# EAGLE design CufflessPTT- v3 (EAGLE 8.7.0)
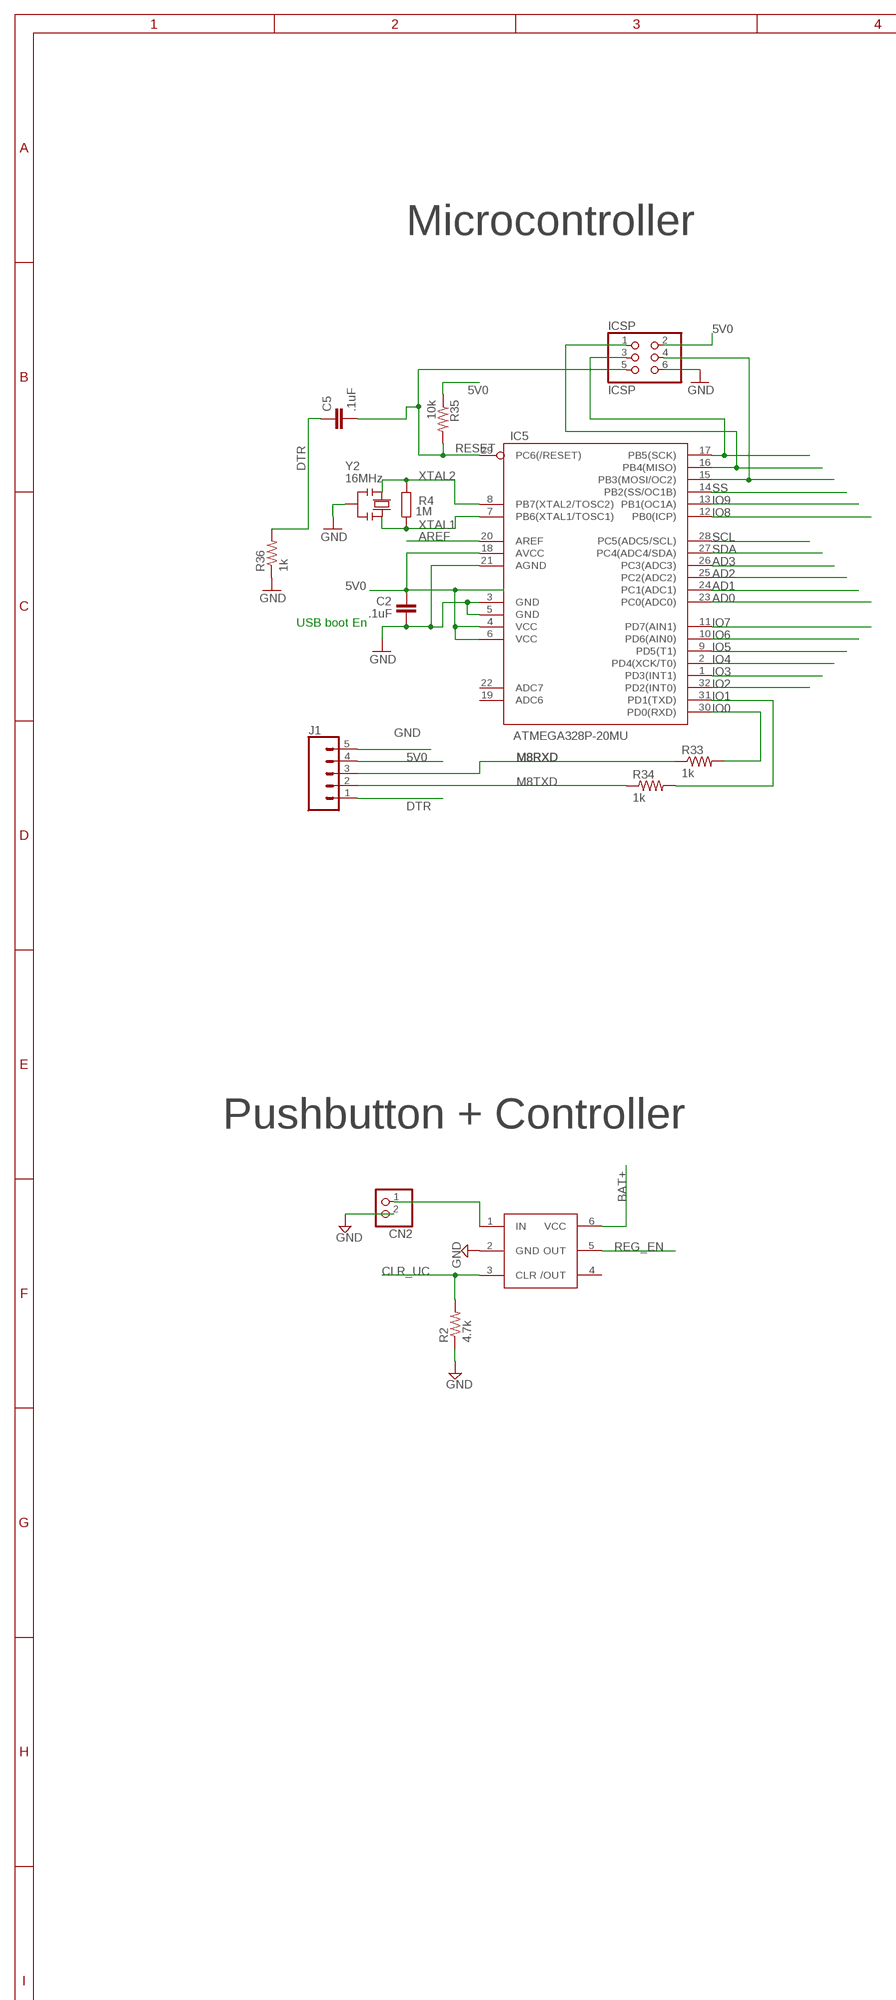
[diagram p0: schematic, sheet 1, part 1 of 2]
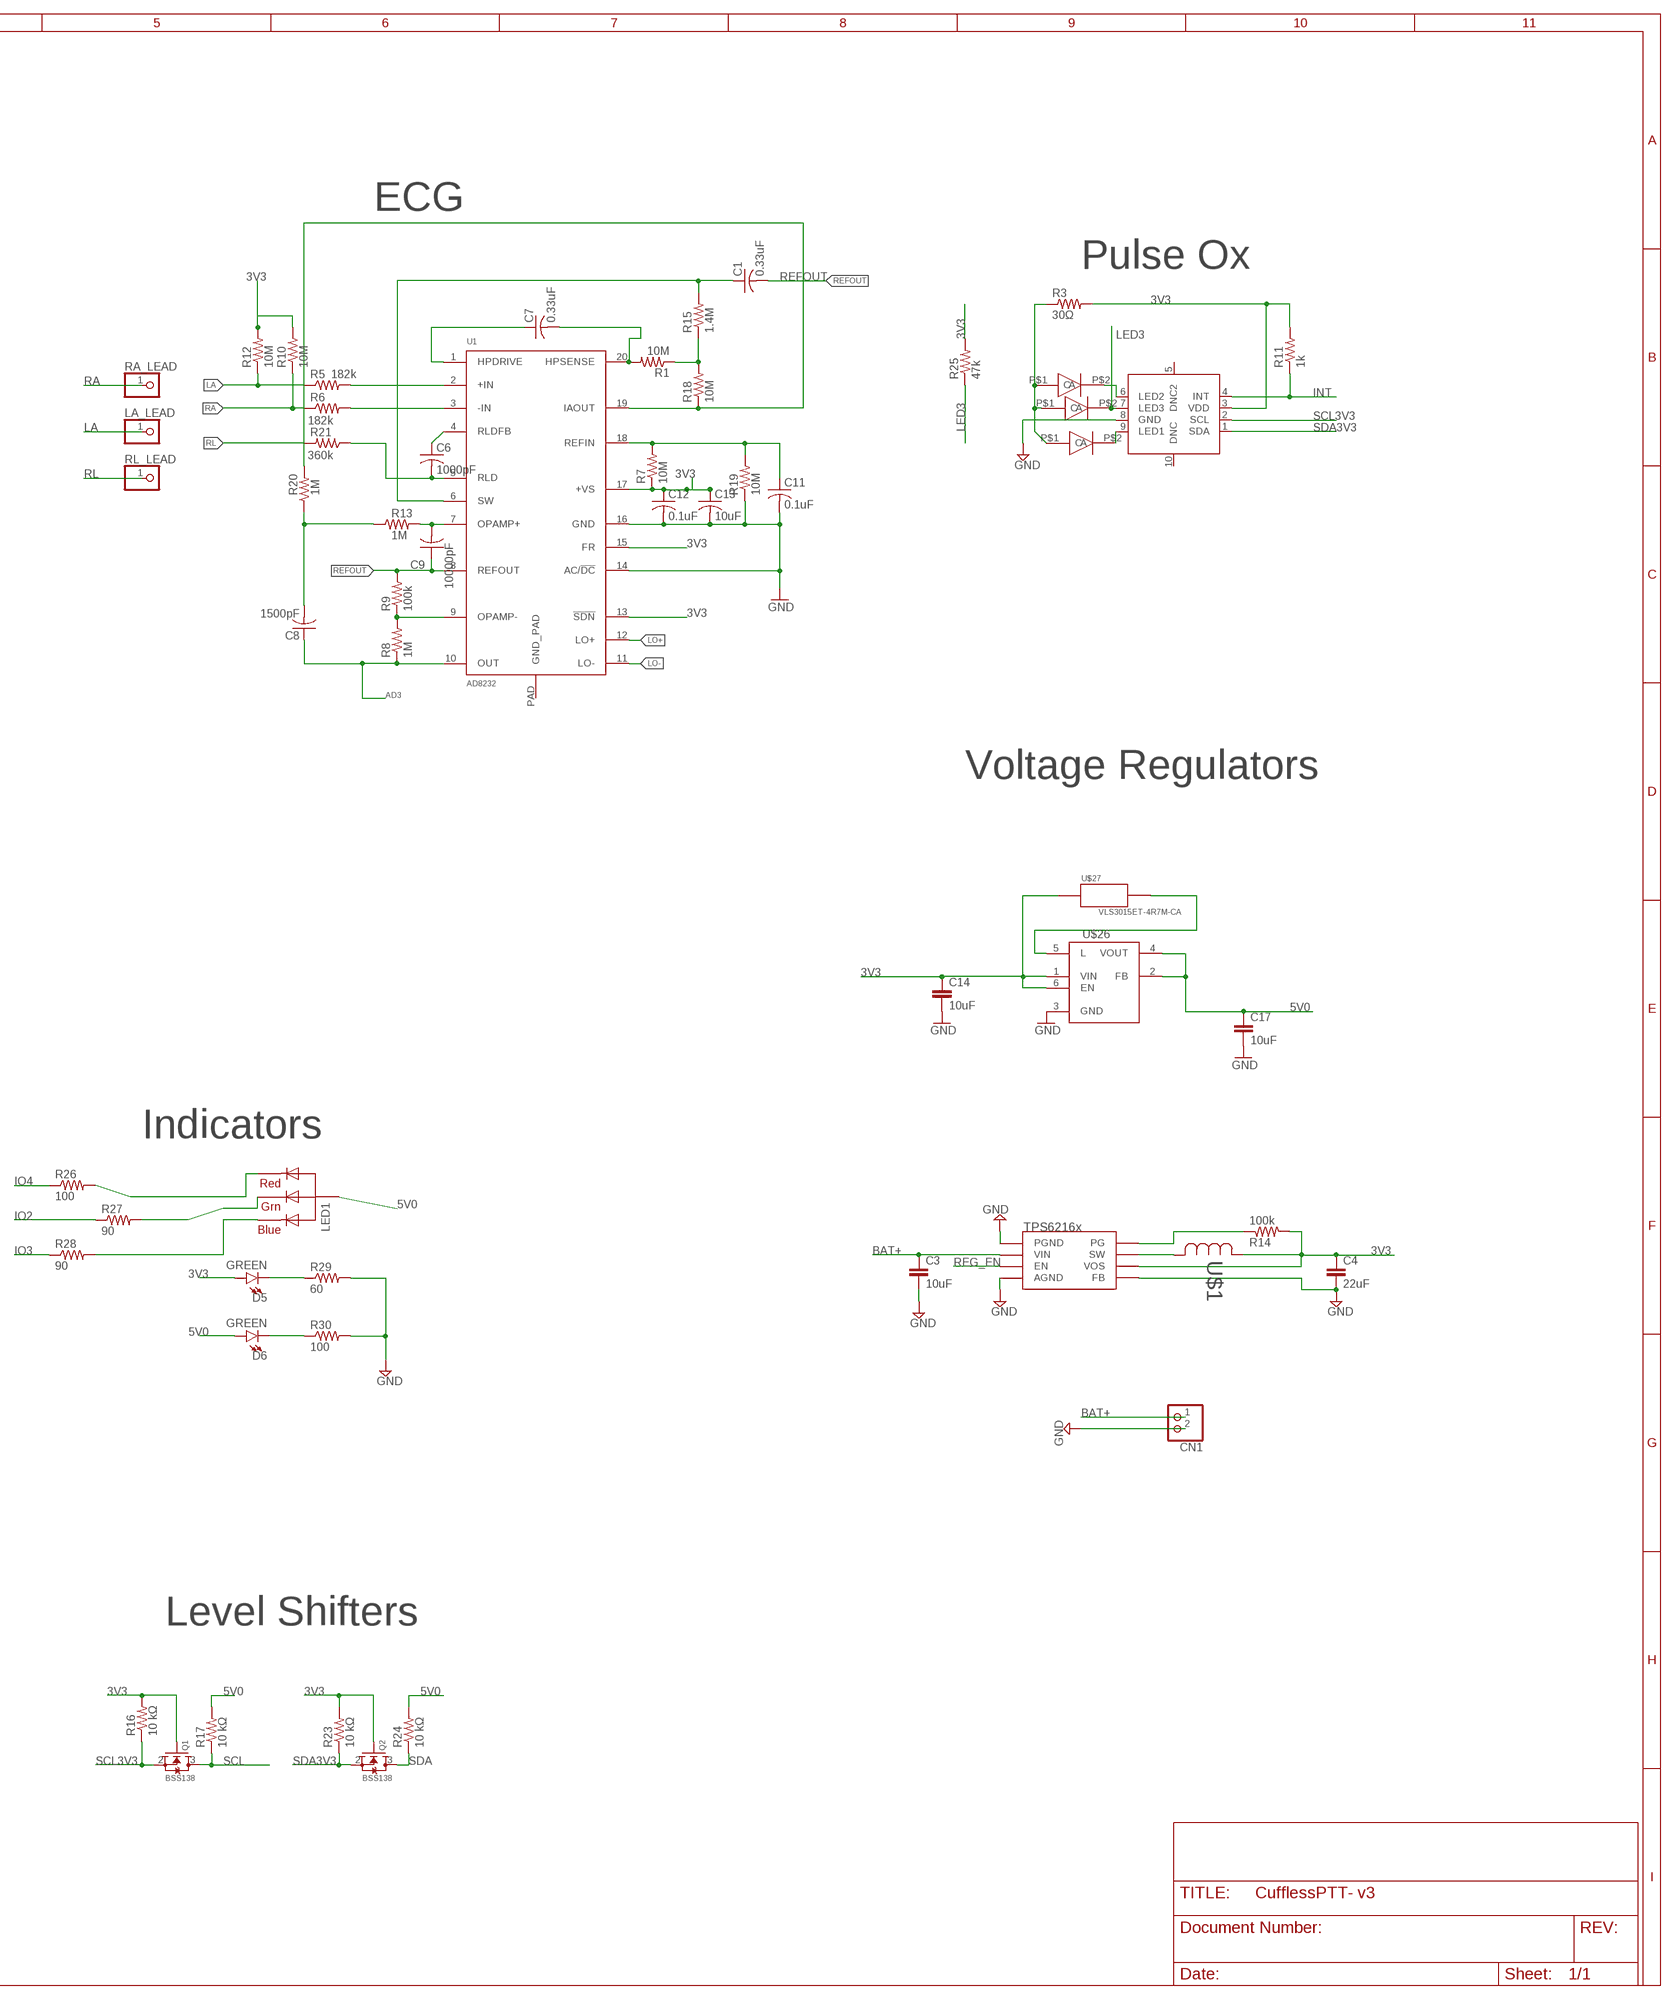
[diagram p1: schematic, sheet 1, part 2 of 2]

## Parts
C1  0.33uF  C-USC0603  [C0603]
C2  .1uF  C-EU0603-RND  [C0603-ROUND]
C3  10uF  C-EUC0603  [C0603]
C4  22uF  C-EUC0805  [C0805]
C5  .1uF  C-EU0603-RND  [C0603-ROUND]
C6  1000pF  C-USC0603  [C0603]
C7  0.33uF  C-USC0603  [C0603]
C8  1500pF  C-USC0603  [C0603]
C9  10000pF  C-USC0603  [C0603]
C11  0.1uF  C-USC0603  [C0603]
C12  0.1uF  C-USC0603  [C0603]
C13  10uF  C-USC0603  [C0603]
C14  10uF  C-EUC0603  [C0603]
C17  10uF  C-EUC0603  [C0603]
CN1  JST_2PIN-THM  [JST-PH-2-THM]
CN2  JST_2PIN-THM  [JST-PH-2-THM]
D5  GREEN  LED-GREEN0603  [LED-0603]
D6  GREEN  LED-GREEN0603  [LED-0603]
IC5  ATMEGA328P-20MU  MEGA8-MI  [MLF32]
ICSP  ICSP  PINHD-2X3  [2X03]
J1  CONN_05  [1X05]
LA_LEAD  PINHD-1X1  [1X01]
LED1  RGBLED_CA-5MM  [LED5MMRGB]
LED2  SMD_COMBO  [SMD_COMBO]
LED3  SMD_COMBO  [SMD_COMBO]
LED4  SMD_COMBO  [SMD_COMBO]
Q1  BSS138  [SOT23-3]
Q2  BSS138  [SOT23-3]
R1  10M  RESISTOR0603-RES  [0603-RES]
R2  4.7k  R-US_R0402  [R0402]
R3  30Ω  R-US_R0402  [R0402]
R4  1M  R-EU_R0603  [R0603-ROUND]
R5  182k  RESISTOR0603-RES  [0603-RES]
R6  182k  RESISTOR0603-RES  [0603-RES]
R7  10M  RESISTOR0603-RES  [0603-RES]
R8  1M  RESISTOR0603-RES  [0603-RES]
R9  100k  RESISTOR0603-RES  [0603-RES]
R10  10M  RESISTOR0603-RES  [0603-RES]
R11  1k  R-US_R0402  [R0402]
R12  10M  RESISTOR0603-RES  [0603-RES]
R13  1M  RESISTOR0603-RES  [0603-RES]
R14  100k  R-US_R0402  [R0402]
R15  1.4M  RESISTOR0603-RES  [0603-RES]
R16  10 kΩ  R-US_R0402  [R0402]
R17  10 kΩ  R-US_R0402  [R0402]
R18  10M  RESISTOR0603-RES  [0603-RES]
R19  10M  RESISTOR0603-RES  [0603-RES]
R20  1M  RESISTOR0603-RES  [0603-RES]
R21  360k  RESISTOR0603-RES  [0603-RES]
R23  10 kΩ  R-US_R0402  [R0402]
R24  10 kΩ  R-US_R0402  [R0402]
R25  47k  R-US_R0402  [R0402]
R26  100  R-US_R0402  [R0402]
R27  90  R-US_R0402  [R0402]
R28  90  R-US_R0402  [R0402]
R29  60  R-US_R0402  [R0402]
R30  100  R-US_R0402  [R0402]
R33  1k  R-US_R0402  [R0402]
R34  1k  R-US_R0402  [R0402]
R35  10k  R-US_R0402  [R0402]
R36  1k  R-US_R0402  [R0402]
RA_LEAD  PINHD-1X1  [1X01]
RL_LEAD  PINHD-1X1  [1X01]
U1  AD8232  [LFCSP_20]
U$1  VLF3012ST-2R2M1R4  [IND_3010]
U$4  SI1143  [QFN-10]
U$5  TPS6216X  [8WSON]
U$15  MAX16054  [TSOT23-6]
U$26  TPS61222  [SOT363_6SOIC]
U$27  VLS3015ET-4R7M-CA  [VLS3015ET-4R7M-CA]
Y2  16MHz  RESONATORMU  [RESONATOR]

## Nets
3V3: C4.1 C12.1 C13.1 C14.1 D5.A Q1.1(G) Q2.1(G) R3.2 R7.1 R10.2 R11.2 R12.2 R14.2 R16.2 R23.2 R25.2 U1.13(!SDN) U1.15(FR) U1.17(+VS) U$1.1 U$4.3(VDD) U$5.P$6(VOS) U$26.1(VIN) U$26.6(EN) U$27.1
5V0: C2.2 C17.1 D6.A IC5.4(VCC) IC5.6(VCC) IC5.18(AVCC) ICSP.2 J1.4 LED1.2(VCC) R17.2 R24.2 R35.1 U$26.2(FB) U$26.4(VOUT)
AD0: IC5.23(PC0(ADC0))
AD1: IC5.24(PC1(ADC1))
AD2: IC5.25(PC2(ADC2))
AD3: C8.1 IC5.26(PC3(ADC3)) R8.1 U1.10(OUT)
AREF [aref]: IC5.20(AREF)
BAT+: C3.1 CN1.1 U$5.P$2(VIN) U$15.6(VCC)
CLR_UC: R2.2 U$15.3(CLR)
DTR: C5.1 J1.1 R36.2
GND [gnd]: C2.1 C3.2 C4.2 C11.2 C12.2 C13.2 C14.2 C17.2 CN1.2 CN2.2 IC5.3(GND) IC5.5(GND) IC5.21(AGND) ICSP.6 J1.5 R2.1 R19.1 R29.2 R30.2 R36.1 U1.14(AC/!DC) U1.16(GND) U$4.8(GND) U$5.P$1(PGND) U$5.P$4(AGND) U$5.P$5(FB) U$5.P$9(AGND) U$15.2(GND) U$26.3(GND) Y2.2
INT: R11.1 U$4.4(INT)
IO0: IC5.30(PD0(RXD)) R33.2
IO1: IC5.31(PD1(TXD)) R34.2
IO2: IC5.32(PD2(INT0)) R27.1
IO3: IC5.1(PD3(INT1)) R28.1
IO4: IC5.2(PD4(XCK/T0)) R26.1
IO5: IC5.9(PD5(T1))
IO6: IC5.10(PD6(AIN0))
IO7: IC5.11(PD7(AIN1))
IO8: IC5.12(PB0(ICP))
IO9: IC5.13(PB1(OC1A))
LA: LA_LEAD.1 R5.1 R12.1
LED3: LED2.P$2(C) R25.1 U$4.7(LED3)
LO+: U1.12(LO+)
LO-: U1.11(LO-)
M8RXD: J1.3 R33.1
M8TXD: J1.2 R34.1
MISO: IC5.16(PB4(MISO)) ICSP.1
MOSI: IC5.15(PB3(MOSI/OC2)) ICSP.4
N$1: R5.2 U1.2(+IN)
N$2: CN2.1 U$15.1(IN)
N$3: C1.1 R15.2 U1.6(SW)
N$4: R1.1 R15.1 R18.2
N$5: C8.2 R13.1 R20.1
N$6: R14.1 U$5.P$8(PG)
N$7: R6.2 U1.3(-IN)
N$8: C9.2 R13.2 U1.7(OPAMP+)
N$10: D5.C R29.1
N$11: C7.2 R1.2 U1.20(HPSENSE)
N$12: C11.1 R7.2 R19.2 U1.18(REFIN)
N$13: U$1.2 U$5.P$7(SW)
N$14: R8.2 R9.1 U1.9(OPAMP-)
N$15: C7.1 U1.1(HPDRIVE)
N$17: C6.1 U1.4(RLDFB)
N$20: D6.C R30.1
N$21: R18.1 R20.2 U1.19(IAOUT)
N$23: C6.2 R21.1 U1.5(RLD)
N$24: LED2.P$1(A) LED3.P$1(A) LED4.P$1(A) R3.1
N$26: U$26.5(L) U$27.2
N$27: LED3.P$2(C) U$4.6(LED2)
N$29: LED1.4(BLUE) R28.2
N$30: LED1.3(GREEN) R27.2
N$31: LED1.1(RED) R26.2
N$32: LED4.P$2(C) U$4.9(LED1)
RA: R6.1 R10.1 RA_LEAD.1
REFOUT: C1.2 C9.1 R9.2 U1.8(REFOUT)
REG_EN: U$5.P$3(EN) U$15.5(OUT)
RESET: C5.2 IC5.29(PC6(/RESET)) ICSP.5 R35.2
RL: R21.2 RL_LEAD.1
SCK: IC5.17(PB5(SCK)) ICSP.3
SCL: IC5.28(PC5(ADC5/SCL)) Q1.3(D) R17.1
SCL3V3: Q1.2(S) R16.1 U$4.2(SCL)
SDA: IC5.27(PC4(ADC4/SDA)) Q2.3(D) R24.1
SDA3V3: Q2.2(S) R23.1 U$4.1(SDA)
SS: IC5.14(PB2(SS/OC1B))
XTAL1: IC5.7(PB6(XTAL1/TOSC1)) R4.1 Y2.3
XTAL2: IC5.8(PB7(XTAL2/TOSC2)) R4.2 Y2.1
Unconnected: IC5.19(ADC6) IC5.22(ADC7) U1.PAD(GND_PAD) U$4.5(DNC2) U$4.10(DNC) U$15.4(/OUT)

## Notes on the sheet
- Microcontroller | ECG
- Pulse Ox
- USB boot En
- Voltage Regulators
- Pushbutton + Controller
- Indicators
- Level Shifters

## Library data of the parts
C1 C6-C9 C11-C13 = rcl:C-US: CAPACITOR, American symbol
C2 C5 = SmartPrj:C-EU: CAPACITOR, European symbol
C3 C14 C17 = rcl:C-EU: CAPACITOR, European symbol; MPN: MCNP16V105M5X11; OC_NEWARK: 13M5148
C4 = rcl:C-EU: CAPACITOR, European symbol; OC_NEWARK: unknown
CN1 CN2 = adafruit:JST_2PIN: JST 2-Pin Connectors of various flavors SMT-RA (S2B-PH-SM4) 4UConnector #17311 SMT (B2B-PH-SM4) THM-RA (S2B-PH) THM (B2B-PH)
D5 D6 = SparkFun-LED:LED-GREEN: Green SMD LED Used in manufacturing of various products at SparkFun Packages: 0603 - SMD 0603 package [Product Link] <http://www.futureelectronics.com/en/technologies/semiconductors/optoelectronics/leds/Pages/9894312-LTST-C190GKT.aspx?CrossPart=HSMG-C190&IM=0> LilyPad 1206 - SMD1206 LilyPad package [Product Link] <http://www.futureelectronics.com/en/Technologies/Product.aspx?ProductID=IN150NGHARVATEKCORPORATION2049943&IM=0> 1206 - SMD1206 package [Product Link] <http://www.futureelectronics.com/en/technologies/semiconductors/optoelectronics/leds/Pages/8315665-LTST-C150KGKT.aspx?IM=0> 1206 Bottom Mount -SMD 1206 Bottom Mount [Product Link] <http://www.digikey.com/product-detail/en/lite-on-inc/LTST-C230KGKT/160-1456-1-ND/386854> SparkFun Products: Pro Mini 328 -5V <https://www.sparkfun.com/products/821> RedBoard <https://www.sparkfun.com/products/12757> MP3 Trigger <https://www.sparkfun.com/products/13720> Makey Makey <https://www.sparkfun.com/products/11076>; PROD_ID: DIO-00821
IC5 = idii:MEGA8: MICROCONTROLLER 8 Kbytes FLASH 1 kbytes SRAM 512 bytes EEPROM USART 6-channel 10 bit ADC 2-channel 8 bit ADC Source: avr.lbr
ICSP = pinhead:PINHD-2X3: PIN HEADER
J1 = SparkFun-Connectors:CONN_05: Multi connection point. Often used as Generic Header-pin footprint for 0.1 inch spaced/style header connections On any of the 0.1 inch spaced packages, you can populate with these: Break Away Headers - Straight <https://www.sparkfun.com/products/116> (PRT-00116) Break Away Male Headers - Right Angle <https://www.sparkfun.com/products/553> (PRT-00553) Female Headers <https://www.sparkfun.com/products/115> (PRT-00115) Break Away Headers - Machine Pin <https://www.sparkfun.com/products/117> (PRT-00117) Break Away Female Headers - Swiss Machine Pin <https://www.sparkfun.com/products/743> (PRT-00743) For SCREWTERMINALS and SPRING TERMINALS visit here: Screw Terimnals on SparkFun.com <https://www.sparkfun.com/search/results?term=Screw+Terminals> (5mm/3.5mm/2.54mm spacing) This device is also useful as a general connection point to wire up your design to another part of your project. Our various solder wires solder well into these plated through hole pads. Hook-Up Wire - Assortment (Stranded, 22 AWG) <https://www.sparkfun.com/products/11375> (PRT-11375) Hook-Up Wire - Assortment (Solid Core, 22 AWG) <https://www.sparkfun.com/products/11367> (PRT-11367) View the entire wire category on our website here <https://www.sparkfun.com/categories/141> Special notes: Molex polarized connector foot print use with SKU : PRT-08231 with associated crimp pins and housings. 1MM SMD Version SKU: PRT-10208
LA_LEAD RA_LEAD RL_LEAD = pinhead:PINHD-1X1: PIN HEADER
LED1 = adafruit:RGBLED_CA: RGB LED, common-anode 5MM Staggered pins 5mm Piranha package http://www.ladyada.net/library/pcb/eaglelibrary.html
LED2-LED4 = Allie_custom:SMD_COMBO
Q1 Q2 = Charles:BSS138: MOSFET N-CH 50V 220MA
R1 R5-R10 R12 R13 R15 R18-R21 = SparkFun-Passives:RESISTOR: Resistor Basic schematic elements and footprints for 0603, 1206, and PTH resistors.
R2 R3 R11 R25 = rcl:R-US_: RESISTOR, American symbol
R4 = SmartPrj:R-EU_: RESISTOR, European symbol
R14 = rcl:R-US_: RESISTOR, American symbol; OC_NEWARK: unknown; SPICEPREFIX: R
R16 R17 R23 R24 R33-R36 = rcl:R-US_: RESISTOR, American symbol; SPICEPREFIX: R
R26-R30 = resistor:R-US_: RESISTOR, American symbol
U1 = AD8232:AD8232
U$1 = Charles:VLF3012ST-2R2M1R4: 2.2µH Shielded Wirewound Inductor 1.4A 72 mOhm Max Nonstandard; OC_NEWARK: unknown
U$4 = Allie_custom:SI1143
U$5 = Charles:TPS6216X: 3-V to 17-V, 1-A Step-Down Converters with DCS-Control; OC_NEWARK: unknown
U$15 = James_custom:MAX16054
U$26 = James_Updated:TPS61222: Boost Switching Regulator IC Positive Fixed 5V/Adj Output 200mA (Switch); OC_NEWARK: unknown
U$27 = James_Updated:VLS3015ET-4R7M-CA: 4.7uH Shielded Wirewound Inductor 1.35A 136mOhm Max Nonstandard Packaging; OC_NEWARK: unknown
Y2 = SmartPrj:RESONATOR

## Net classes
1 power: width 0.406 mm, drill 0.61 mm, clearance 0.152 mm
2 gnd: width 0.203 mm, drill 0.559 mm, clearance 0.152 mm
3 usbvcc: width 0.203 mm, drill 0.61 mm, clearance 0.152 mm
4 aref: width 0.203 mm, drill 0.61 mm, clearance 0.152 mm

## Board
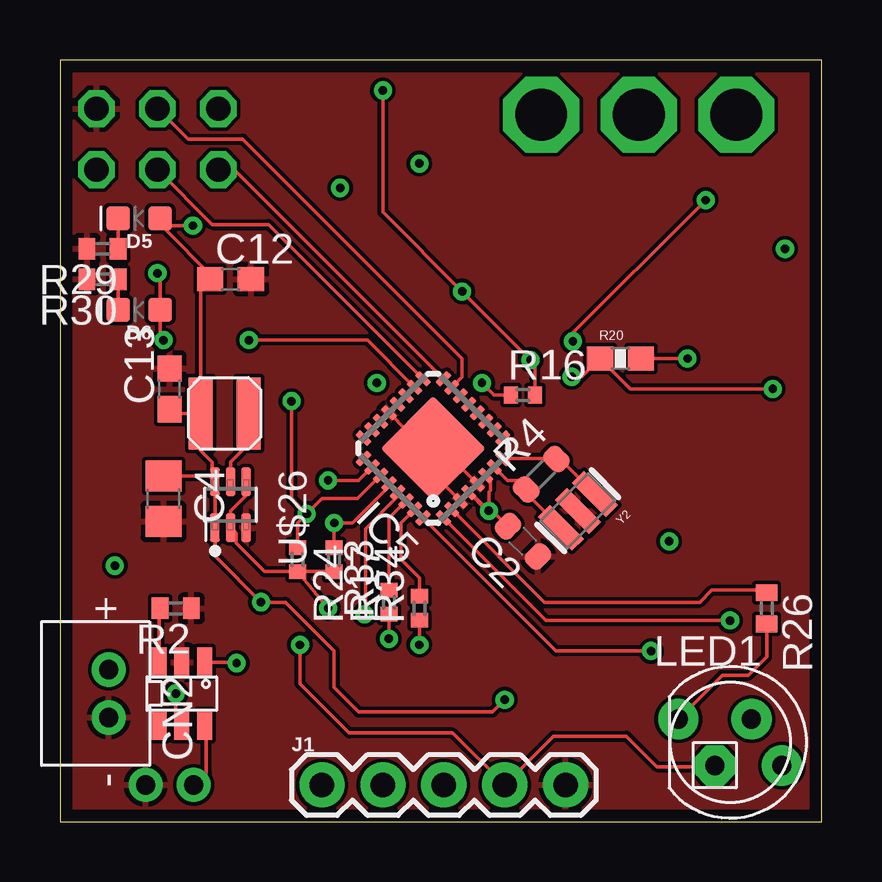
[diagram p2: board, top side]
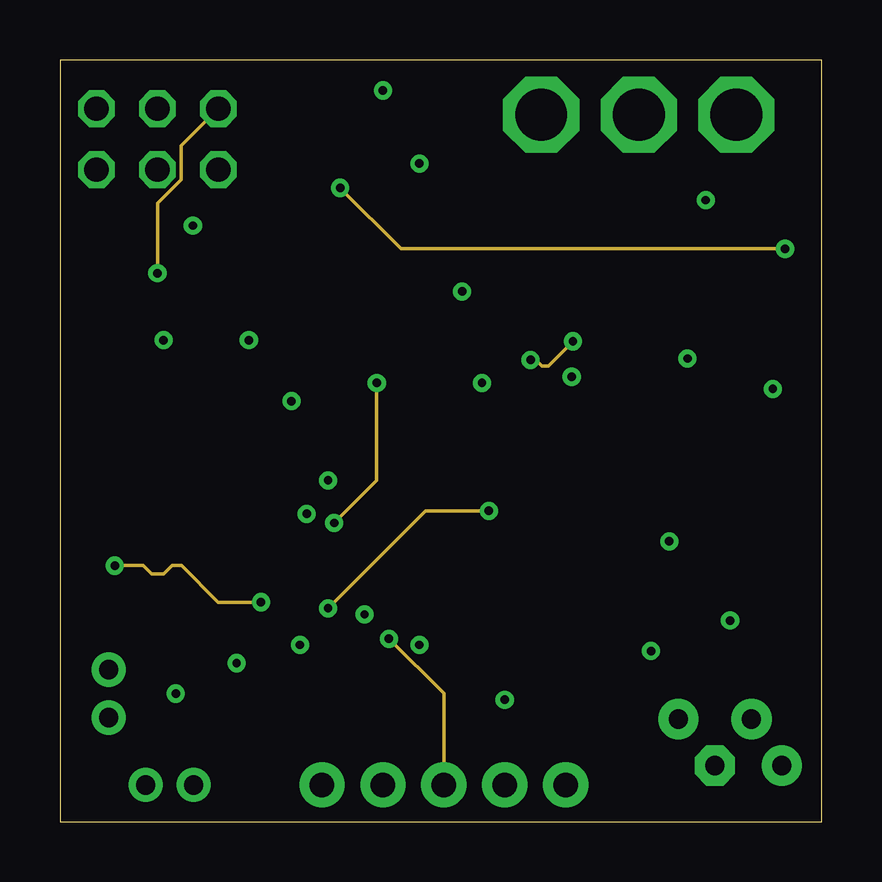
[diagram p3: board, inner layer Route2]
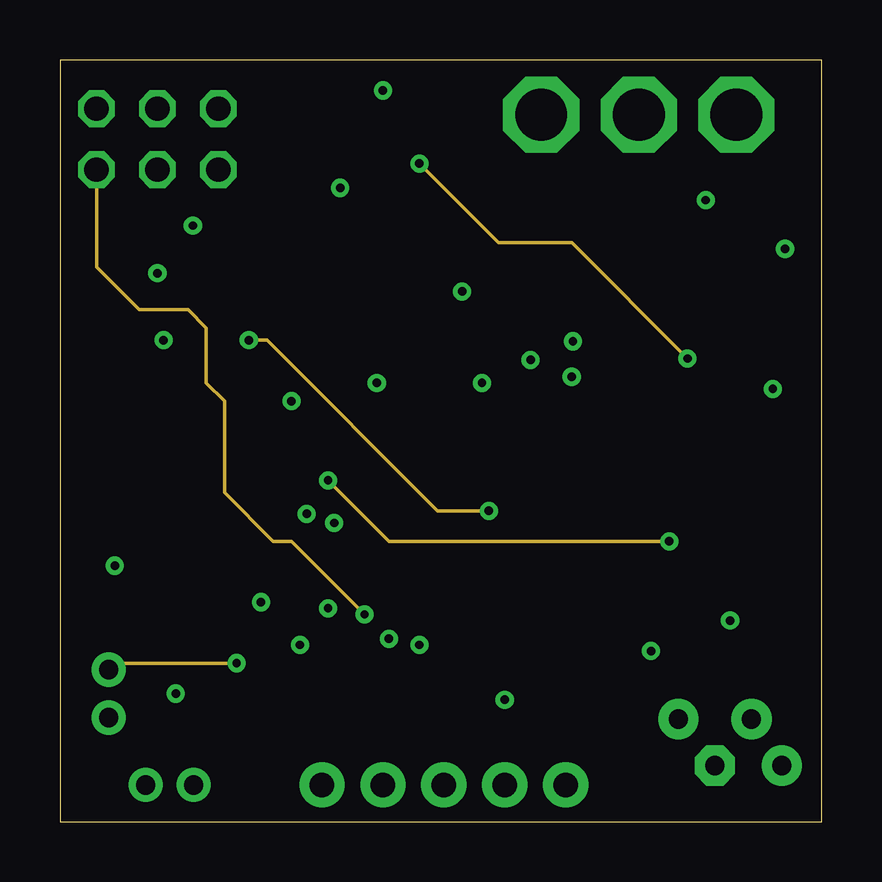
[diagram p4: board, inner layer Route15]
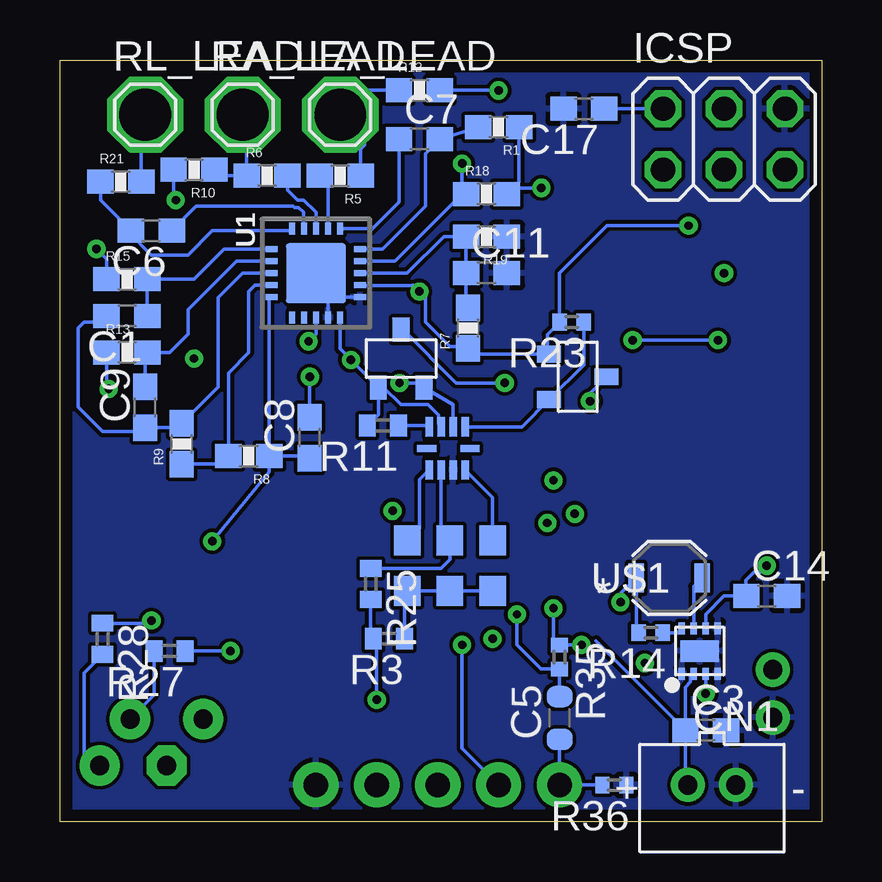
[diagram p5: board, bottom side, seen from below]

Size 31.75 x 31.75 mm. Coordinates in mm from the lower left corner, seen from the top.
Outline: 0,0 31.75,0 31.75,31.75 0,31.75 0,0
Copper layers (1*2+15*16): Top 0.035mm / dielectric 0.49mm / Route2 0.035mm / dielectric 0.49mm / Route15 0.035mm / dielectric 0.49mm / Bottom 0.035mm
Design rules "default *": minimum track width 1mil, minimum drill 8mil, track to track 6mil, track to pad 6mil, pad to pad 6mil, via to via 6mil, smd to smd 6mil, copper to edge 20mil, drill to drill 8mil, minimum pad ring 10mil, minimum via ring 8mil, stop-mask expansion 4mil, vias tented up to drill 0mil, thermal gap 8mil

### Footprints (pad centres in the part's own frame; a part is rotated, then mirrored left to right if it is on the bottom)
C0603 = smd 1.1 x 1: 1 -0.85,0; 2 0.85,0
C0603-ROUND = smd 0.898 x 1.1: 1 -0.889,0; 2 0.889,0
C0805 = smd 1.3 x 1.5: 1 -0.95,0; 2 0.95,0
JST-PH-2-THM = drill 0.8 pad 1.422: 1 1,0; 2 -1,0
LED-0603 = smd 1 x 1: A -0.877,0; C 0.877,0
MLF32 = smd 0.7 x 0.3: 1 -2.35,1.75; 2 -2.35,1.25; 3 -2.35,0.75; 4 -2.35,0.25; 5 -2.35,-0.25; 6 -2.35,-0.75; 7 -2.35,-1.25; 8 -2.35,-1.75; 17 2.35,-1.75; 18 2.35,-1.25; 19 2.35,-0.75; 20 2.35,-0.25; 21 2.35,0.25; 22 2.35,0.75; 23 2.35,1.25; 24 2.35,1.75 | smd 0.3 x 0.7: 9 -1.75,-2.35; 10 -1.25,-2.35; 11 -0.75,-2.35; 12 -0.25,-2.35; 13 0.25,-2.35; 14 0.75,-2.35; 15 1.25,-2.35; 16 1.75,-2.35; 25 1.75,2.35; 26 1.25,2.35; 27 0.75,2.35; 28 0.25,2.35; 29 -0.25,2.35; 30 -0.75,2.35; 31 -1.25,2.35; 32 -1.75,2.35 | smd 3.1 x 3.1: PAD 0,0
2X03 = drill 1.016 octagon: 1 -2.54,-1.27; 2 -2.54,1.27; 3 0,-1.27; 4 0,1.27; 5 2.54,-1.27; 6 2.54,1.27
1X05 = drill 1.016 pad 1.88: 1 0,0; 2 2.54,0; 3 5.08,0; 4 7.62,0; 5 10.16,0
1X01 = drill 2.159 octagon: 1 0,0
LED5MMRGB = drill 0.8 pad 1.676: 1 -2.159,0.968; 3 0.889,0.968; 4 2.159,-0.968 | drill 0.8 pad 1.676 octagon: 2 -0.635,-0.968
SMD_COMBO = smd 1.25 x 1.1: P$1 -1.05,0; P$2 1.05,0
SOT23-3 = smd 0.7 x 1: 1 -0.95,-1.2; 2 0.95,-1.2; 3 0,1.2
0603-RES = smd 1.1 x 1: 1 -0.85,0; 2 0.85,0
R0402 = smd 0.7 x 0.9: 1 -0.65,0; 2 0.65,0
R0603-ROUND = smd 0.898 x 1.1: 1 -0.889,0; 2 0.889,0
R0402' = smd 0.6 x 0.7: 1 -0.5,0; 2 0.5,0
LFCSP_20 = smd 0.5 x 0.25: 1 -1.85,1; 2 -1.85,0.5; 3 -1.85,0; 4 -1.85,-0.5; 5 -1.85,-1; 11 1.85,-1; 12 1.85,-0.5; 13 1.85,0; 14 1.85,0.5; 15 1.85,1 | smd 0.25 x 0.5: 6 -1,-1.85; 7 -0.5,-1.85; 8 0,-1.85; 9 0.5,-1.85; 10 1,-1.85; 16 1,1.85; 17 0.5,1.85; 18 0,1.85; 19 -0.5,1.85; 20 -1,1.85 | smd 2.5 x 2.5: PAD 0,0
IND_3010 = smd 0.65 x 1.2: 1 -1.375,0; 2 1.375,0
QFN-10 = smd 0.8 x 0.3: 1 -0.9,0.7; 2 -0.9,0.2; 3 -0.9,-0.3; 4 -0.9,-0.8; 6 0.9,-0.8; 7 0.9,-0.3; 8 0.9,0.2; 9 0.9,0.7 | smd 0.3 x 0.8: 5 0,-0.9; 10 0,0.9
8WSON = smd 0.5 x 0.28: P$1 -0.95,0.75; P$2 -0.95,0.25; P$3 -0.95,-0.25; P$4 -0.95,-0.75; P$5 0.95,-0.75; P$6 0.95,-0.25; P$7 0.95,0.25; P$8 0.95,0.75 | smd 0.9 x 1.6: P$9 0,0
TSOT23-6 = smd 0.62 x 1.22: 1 0.95,1.31; 2 0,1.31; 3 -0.95,1.31; 4 -0.95,-1.31; 5 0,-1.31; 6 0.95,-1.31
SOT363_6SOIC = smd 1.19 x 0.4: 1 -0.96,0.65; 2 -0.96,0; 3 -0.96,-0.65; 4 0.96,-0.65; 5 0.96,0; 6 0.96,0.65
VLS3015ET-4R7M-CA = smd 1 x 3: 1 -1,0; 2 1,0
RESONATOR = smd 0.7 x 2: 1 -1,0; 2 0,0; 3 1,0

### Placement (x,y rotation side)
C1  28.96,21.08 180 bottom
C2  19.3,11.68 135 top
C3  4.83,3.81 0 bottom
C4  4.32,13.46 270 top
C5  10.92,4.32 90 bottom
C6  27.94,24.64 180 bottom
C7  16.76,28.45 0 bottom
C8  21.34,16 90 bottom
C9  28.19,17.27 90 bottom
C11  13.97,22.86 0 bottom
C12  7.11,22.61 0 top
C13  4.57,18.03 90 top
C14  2.29,9.4 0 bottom
C17  9.91,29.72 180 bottom
CN1  4.57,1.52 180 bottom
CN2  2.03,5.33 90 top
D5  3.3,25.15 180 top
D6  3.3,21.34 180 top
IC5  15.56,15.56 135 top
ICSP  4.06,28.45 0 bottom
J1  10.92,1.52 0 top
LA_LEAD  20.07,29.46 0 bottom
LED1  27.94,3.3 0 top
LED2  15.49,10.67 90 bottom
LED3  17.27,10.67 90 bottom
LED4  13.72,10.67 90 bottom
Q1  17.53,19.3 0 bottom
Q2  10.16,18.54 270 bottom
R1  13.46,28.96 180 bottom
R2  4.83,8.89 180 top
R3  18.03,7.62 180 bottom
R4  20.07,14.48 45 top
R5  20.07,26.92 180 bottom
R6  23.11,26.92 0 bottom
R7  14.73,20.57 90 bottom
R8  23.88,15.24 180 bottom
R9  26.67,15.75 90 bottom
R10  26.16,27.18 180 bottom
R11  18.29,16.51 180 bottom
R12  16.76,30.48 0 bottom
R13  28.96,19.56 0 bottom
R14  100k  [R0402']  7.12,7.87 180 bottom
R15  28.96,22.61 0 bottom
R16  10 kΩ  [R0402']  19.3,17.78 0 top
R17  10 kΩ  [R0402']  11.43,10.92 270 top
R18  13.97,26.16 0 bottom
R19  13.97,24.38 180 bottom
R20  23.37,19.3 0 top
R21  29.21,26.67 0 bottom
R23  10 kΩ  [R0402']  10.41,20.83 180 bottom
R24  10 kΩ  [R0402']  9.91,10.92 270 top
R25  18.8,9.91 270 bottom
R26  29.46,8.89 270 top
R27  27.18,7.11 180 bottom
R28  29.97,7.62 270 bottom
R29  1.78,23.88 180 top
R30  1.78,22.61 180 top
R33  1k  [R0402']  13.72,9.14 90 top
R34  1k  [R0402']  14.99,8.89 90 top
R35  10k  [R0402']  10.92,6.86 270 bottom
R36  1k  [R0402']  8.64,1.52 180 bottom
RA_LEAD  24.13,29.46 0 bottom
RL_LEAD  28.19,29.46 0 bottom
U1  21.08,22.86 270 bottom
U$1  6.35,10.16 0 bottom
U$4  15.56,15.56 270 bottom
U$5  5.08,7.11 90 bottom
U$15  5.08,5.33 0 top
U$26  7.11,13.21 90 top
U$27  6.86,17.02 0 top
Y2  21.59,12.95 225 top

### Tracks (layer width: path | path; a pad name or v marks a point on that pad's centre or on a via)
3V3  (via drill 0.35)
  Top 0.152: U$26.6 U$26.1 6.46,11.06 v8.38,9.14 9.4,9.14 11.43,7.11 11.43,5.59 12.45,4.57 18.03,4.57 v18.54,5.08 | U$26.6 6.22,14.41 C4.1 | U$26.6 6.35,14.28 6.35,14.99 5.84,15.49 5.84,17 | 5.84,17 U$27.1 5.86,22.2 C12.1 6.26,22.81 4.38,24.7 | C13.1 4.39,17 5.84,17 | v13.46,30.48 13.46,25.4 v16.76,22.1 v19.62,19.25 19.8,19.06 R16.2 | v26.92,25.91 21.08,20.07 21.34,20.07 v21.38,20.02 | D5.A 4.38,24.7 | v5.54,24.84 4.52,24.84 4.38,24.7
  Route2 0.152: v2.29,10.67 3.46,10.67 3.81,10.31 4.32,10.31 4.67,10.67 5.08,10.67 6.6,9.14 v8.38,9.14 | v19.62,19.25 19.85,19.25 20.1,19 20.36,19 v21.38,20.02
  Bottom 0.152: R14.2 7.72,7.98 U$1.1 8.38,9.5 v8.38,9.14 | R25.2 18.8,7.73 R3.2 18.54,7.48 v18.54,5.08 | R11.2 18.48,16.97 Q1.1 | Q1.1 v19.62,19.25 20.08,19.71 U1.15 | v13.46,30.48 R12.2 | 17.02,22.35 17.03,22.36 | 17.02,22.35 U1.17 | R10.2 27.01,26 v26.92,25.91 | 11.43,19.49 14.25,19.49 R7.1 14.82,19.81 15.49,19.81 16.51,20.83 16.51,21.84 v16.76,22.1 17.02,22.35 | 11.43,19.49 Q2.1 | 11.43,19.49 11.43,20.31 R23.2 10.92,20.84 10.92,22.86 8.94,24.84 v5.54,24.84 | U$4.3 15.98,16.58 15.98,16.95 16.4,17.38 17.54,17.38 18.27,18.1 Q1.1 | 2.29,10.5 v2.29,10.67 2.54,10.41 2.79,10.41 3.16,10.05 3.16,9.39 C14.1 4.06,9.4 4.83,8.64 U$5.P$6 | U1.13 21.08,20.32 v21.38,20.02
5V0  (via drill 0.35)
  Top 0.152: R17.2 R24.2 | R24.2 8.53,10.42 7.33,11.62 7.33,12.03 U$26.2 7.11,12.95 7.76,13.6 U$26.4 | v11.18,8.89 R24.2 | v4.06,22.86 4.18,22.75 D6.A 4.18,20.2 v4.32,20.07 | IC5.18 12.82,20.07 v7.87,20.07 | v17.88,12.95 18.03,12.95 C2.2 | v17.88,12.95 17.88,13.74 17.95,13.8 17.95,14.23 IC5.6 | v17.88,12.95 17.11,13.72 IC5.4 17.81,12.95 v17.88,12.95 | LED1.2 27.26,2.29 24.89,2.29 23.62,3.56 20.57,3.56 J1.4 16.37,3.69 12.05,3.69 10.01,5.74 v10.01,7.37
  Route2 0.152: v4.06,22.86 4.06,25.78 5.05,26.77 5.05,28.17 ICSP.2 | v11.18,8.89 15.24,12.95 v17.88,12.95
  Route15 0.152: 18.54,2.03 J1.4 | v7.87,20.07 8.64,20.07 15.75,12.95 v17.88,12.95
  Bottom 0.152: C17.1 ICSP.2 | v11.18,8.89 11.18,7.61 R35.1 10.01,7.36 v10.01,7.37 | v7.87,20.07 v4.32,20.07
AD3  (via drill 0.35)
  Top 0.152: IC5.26 12.46,14.22 v11.18,14.22
  Route15 0.152: v11.18,14.22 13.72,11.68 v25.4,11.68
  Bottom 0.152: R8.1 23.03,21.77 U1.10 | v25.4,11.68 23.03,14.57 R8.1 | C8.1 21.42,15.24 R8.1
BAT+
  Top 0.152: CN1.1 6.08,2.03 6.1,2.03 6.1,3.96 U$15.6
  Bottom 0.152: CN1.1 5.68,1.63 C3.1 | C3.1 9.4,7.53 | U$5.P$2 5.46,6.03 5.46,5.82 5.68,5.6 C3.1
CLR_UC
  Top 0.152: U$15.3 4.13,8.84 R2.2
DTR
  Bottom 0.152: C5.1 J1.1 R36.2
GND
  Top 0.152: IC5.3 14.48,15.58 14.48,16.28 | 14.48,16.28 IC5.21 | IC5.5 15.19,16.28 14.48,16.28
  Bottom 0.152: 10.76,29.88 C17.2 | 4.32,7.11 U$5.P$9 | U1.16 20.56,21.86 20.58,21.84 U1.14
  pour Bottom: 0,31.75 31.5,31.75 31.75,0 0,0
  pour Top: 0,31.75 31.75,31.75 31.75,0 0,0
INT
  Bottom 0.152: U$4.4 16.41,16.51 R11.1
IO0
  Top 0.152: IC5.30 13.72,12.65 R33.2
IO1
  Top 0.152: IC5.31 14.22,12.46 14.22,10.92 14.99,10.16 R34.2
IO2  (via drill 0.35)
  Top 0.152: v24.64,7.11 20.68,7.11 IC5.32
  Bottom 0.152: R27.1 v24.64,7.11
IO3  (via drill 0.35)
  Top 0.152: IC5.1 20.26,8.38 v27.94,8.38
  Bottom 0.152: R28.1 28.05,8.27 v27.94,8.38
IO4
  Top 0.152: 16.34,12.88 IC5.2 20.2,9.14 26.67,9.14 27.18,9.65 29.35,9.65 R26.1
LA
  Bottom 0.152: R5.1 19.22,28.03 19.05,28.19 19.05,28.45 LA_LEAD.1 19.05,30.48 R12.1
LED3
  Bottom 0.152: U$4.7 15.86,12.08 LED2.P$2 15.49,10.92 15.86,10.56 R25.1
M8RXD  (via drill 0.35)
  Top 0.152: R33.1 v13.72,7.62
  Route2 0.152: v13.72,7.62 16,5.33 J1.3
M8TXD  (via drill 0.35)
  Top 0.152: R34.1 v14.99,7.37
  Bottom 0.152: v14.99,7.37 14.99,3.05 J1.2
MISO
  Top 0.152: ICSP.1 7.26,27.18 IC5.16
MOSI
  Top 0.152: ICSP.4 5.33,28.45 7.62,28.45 16.76,19.3 16.76,18.53 IC5.15
N$1
  Bottom 0.152: U1.2 20.58,26.59 R5.2
N$2  (via drill 0.35)
  Top 0.152: U$15.1 7.33,6.64 v7.37,6.6
  Route15 0.152: v7.37,6.6 2.3,6.6 CN2.1
N$3
  Bottom 0.152: U1.6 24.91,23.86 26.16,22.61 R15.2 C1.1
N$4  (via drill 0.35)
  Route2 0.152: v30.23,23.88 14.22,23.88 v11.68,26.42
  Bottom 0.152: R1.1 12.61,26.67 R18.2 12.87,26.42 v11.68,26.42 | R15.1 29.81,23.46 v30.23,23.88
N$5  (via drill 0.35)
  Top 0.152: v29.72,18.03 23.79,18.03 R20.1 21.76,18.54 v21.34,18.54
  Bottom 0.152: R13.1 29.81,18.12 v29.72,18.03 | v21.34,18.54 C8.2
N$6
  Bottom 0.152: U$5.P$8 6.02,7.87 R14.1
N$7
  Bottom 0.152: U1.3 21.08,25.4 21.59,25.91 21.84,25.91 22.26,26.33 R6.2
N$8
  Bottom 0.152: U1.7 24.38,23.36 24.38,23.37 26.42,21.34 26.42,20.32 27.18,19.56 R13.2 28.19,19.47 C9.2
N$10
  Top 0.152: R29.1 2.43,24.89 D5.C
N$11
  Bottom 0.152: 15.83,28.54 C7.2 | C7.2 16.51,27.85 16.51,25.65 18.3,23.86 U1.20 | R1.2 C7.2
N$12
  Bottom 0.152: U1.18 17.27,22.86 15.75,24.38 R19.2 | R19.2 C11.1 14.82,21.77 R7.2 | 14.82,24.64 R19.2
N$13
  Bottom 0.152: U$1.2 5.33,9.8 U$5.P$7
N$14
  Bottom 0.152: R9.1 25.07,14.9 R8.2 24.73,18.71 23.88,19.56 23.88,22.1 23.61,22.36 U1.9
N$15
  Bottom 0.152: C7.1 17.61,25.82 18.8,24.64 18.87,24.71 U1.1
N$17
  Bottom 0.152: U1.4 21.59,25.4 21.79,25.6 21.97,25.6 22.02,25.65 26.07,25.65 C6.1
N$20
  Top 0.152: R30.1 2.43,21.09 D6.C
N$21  (via drill 0.35)
  Top 0.152: v26.16,19.3 R20.2
  Route15 0.152: v14.99,27.43 18.29,24.13 21.34,24.13 v26.16,19.3
  Bottom 0.152: U1.19 17.79,23.36 14.99,26.16 R18.1 14.99,26.33 v14.99,27.43
N$23
  Bottom 0.152: C6.2 28.87,24.72 | 28.87,24.72 30.06,25.91 R21.1 | U1.5 22.15,24.64 25.4,24.64 26.42,23.62 27.94,23.62 28.87,24.55 28.87,24.72
N$24
  Bottom 0.152: LED4.P$1 LED2.P$1 LED3.P$1 17.38,9.51 R3.1
N$26
  Top 0.152: U$27.2 7.86,15.73 7.11,14.99 U$26.5
N$27
  Bottom 0.152: U$4.6 16.76,14.25 16.76,12.23 LED3.P$2
N$29
  Bottom 0.152: R28.2 30.73,6.21 30.73,2.79 30.56,2.79 LED1.4
N$30
  Bottom 0.152: R27.2 27.83,5.27 LED1.3
N$31
  Top 0.152: 25.78,4.19 LED1.1 27.61,6.1 28.7,6.1 29.46,6.86 R26.2
N$32
  Bottom 0.152: U$4.9 13.72,13.52 LED4.P$2
RA
  Bottom 0.152: RA_LEAD.1 23.96,29.3 R6.1 25.06,26.92 R10.1
REFOUT
  Bottom 0.152: U1.8 24.13,22.86 25.15,21.84 25.15,18.12 R9.2 26.85,16.42 C9.1 28.36,16.26 29.97,16.26 30.99,17.27 30.99,20.57 30.73,20.83 30.06,20.83 C1.2
REG_EN  (via drill 0.35)
  Top 0.152: U$15.5 4.83,4.28 v4.83,5.33
  Bottom 0.152: v4.83,5.33 U$5.P$3
RESET  (via drill 0.35)
  Top 0.152: IC5.29 14.07,13.55 12.73,12.21 12.73,8.92 v12.7,8.64
  Route15 0.152: ICSP.5 1.52,23.11 3.3,21.34 5.33,21.34 6.1,20.57 6.1,18.29 6.86,17.53 6.86,13.72 8.89,11.68 9.65,11.68 v12.7,8.64
  Bottom 0.152: C5.2 R35.2 11.69,6.36 12.7,7.37 v12.7,8.64
RL
  Bottom 0.152: R21.2 28.36,29.3 RL_LEAD.1
SCK
  Top 0.152: ICSP.3 6.35,24.89 8.7,24.89 IC5.17
SCL  (via drill 0.35)
  Top 0.152: R17.1 v11.43,12.45 12.19,12.45 13.72,13.97 IC5.28
  Route2 0.152: v13.21,18.29 13.21,14.22 v11.43,12.45
  Bottom 0.152: 17.53,20.23 Q1.3 17.46,20.5 15.24,18.29 v13.21,18.29 | 11.43,12.6 v11.43,12.45
SCL3V3  (via drill 0.35)
  Top 0.152: v17.59,18.29 18.1,17.78 R16.1
  Bottom 0.152: U$4.2 15.36,17.39 Q1.2 16.76,18.29 v17.59,18.29
SDA  (via drill 0.35)
  Top 0.152: R24.1 9.91,12.45 v10.29,12.83 | v10.29,12.83 10.92,13.46 12.4,13.46 IC5.27 | v9.65,17.53 9.65,13.46 v10.29,12.83
  Bottom 0.152: v9.65,17.53 9.65,17.85 Q2.3
SDA3V3
  Bottom 0.152: R23.1 9.91,19.04 Q2.2 12.49,16.46 U$4.1
XTAL1
  Top 0.152: Y2.3 | 20.88,12.4 Y2.3 | Y2.3 19.44,13.69 R4.1 19.06,14.22 18.66,14.22 IC5.7 | Y2.3
XTAL2
  Top 0.152: 20.67,15.13 | 20.67,15.13 R4.2 | 20.85,15.11 Y2.1 20.85,15.11 | 20.85,15.11 | 20.85,15.11 R4.2 | R4.2 | R4.2 20.67,15.13 | 20.67,15.13 IC5.8